# EAGLE design 18V to 26V Boost v3 (National) (EAGLE 6.5.0)
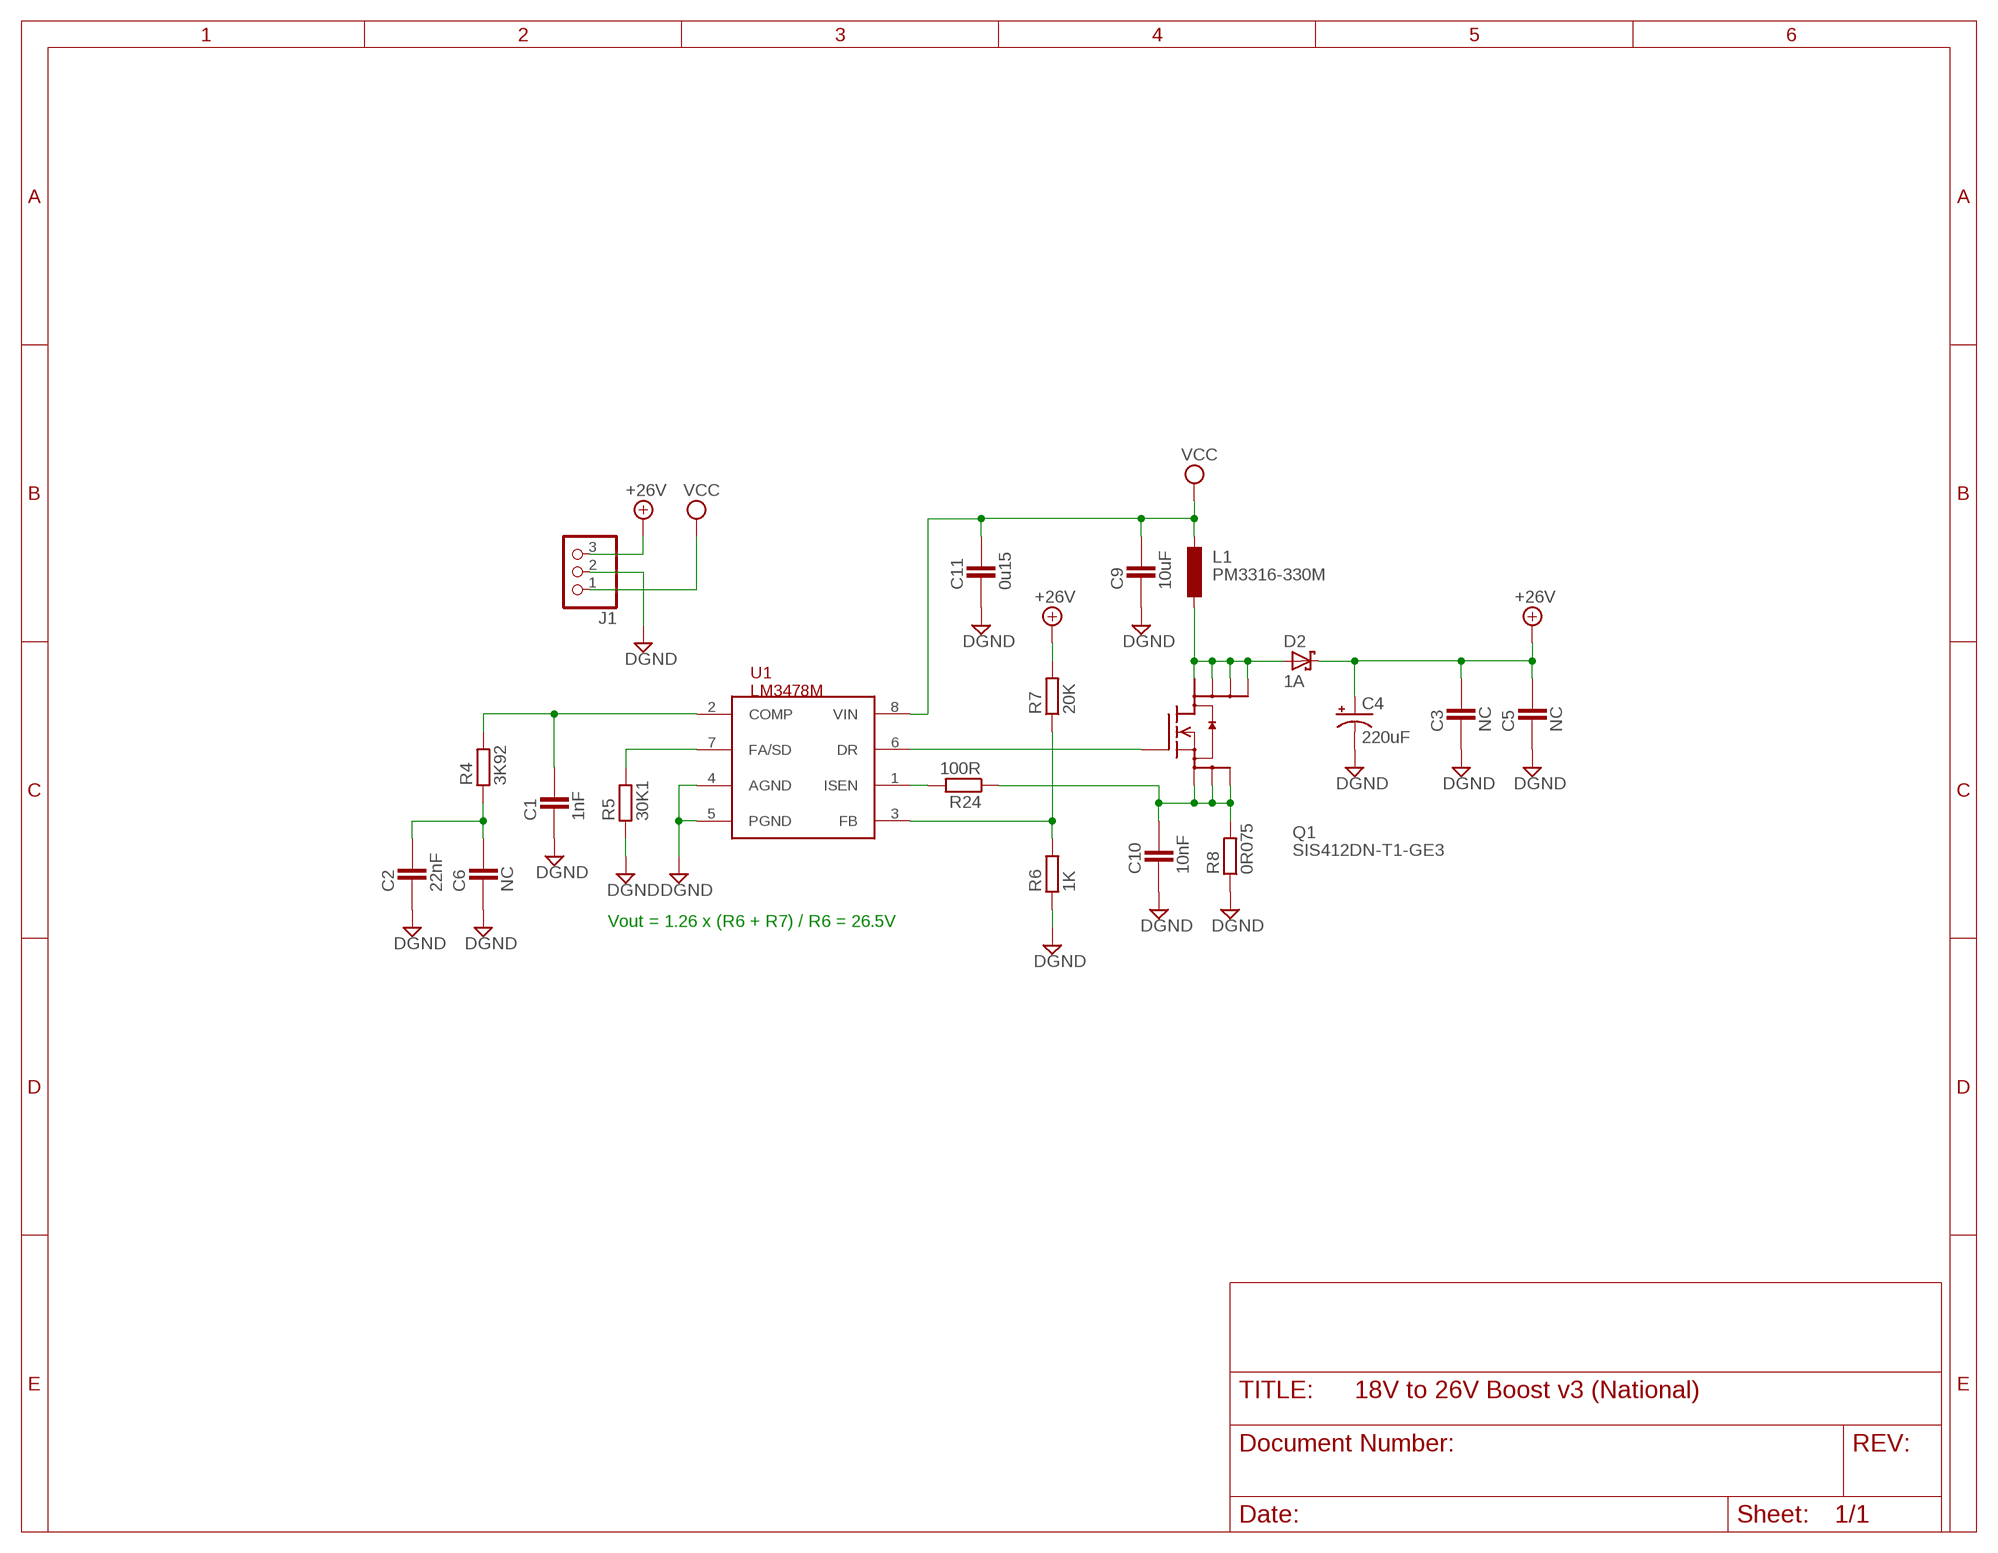
[diagram p0: schematic, sheet 1]

## Parts
C1  1nF  CAPACITOR_0805N  [CAP2012X70N]
C2  22nF  CAPACITOR_0603  [CAPC1608X92N]
C3  NC  CAPACITOR_1210  [CAPC3225X168N]
C4  220uF  CAP_POLG  [PANASONIC_G]
C5  NC  CAPACITOR_1210  [CAPC3225X168N]
C6  NC  CAPACITOR_0603  [CAPC1608X92N]
C9  10uF  CAPACITOR_1210  [CAPC3225X168N]
C10  10nF  CAPACITOR_0603  [CAPC1608X92N]
C11  0u15  CAPACITOR_0805N  [CAP2012X70N]
D2  1A  SCHOTTKY_SMB  [DIOM5436X265N]
J1  PINHD-1X3  [1X03]
L1  PM3316-330M  DO3316P  [DO3316P]
Q1  SIS412DN-T1-GE3  MOSFET-NCH_8_1212  [POWER-PAK1212]
R4  3K92  RESISTOR_0603  [RESC1608X55N]
R5  30K1  RESISTOR_0603  [RESC1608X55N]
R6  1K  RESISTOR_0603  [RESC1608X55N]
R7  20K  RESISTOR_0603  [RESC1608X55N]
R8  0R075  RESISTOR_2512  [RESC6432X70N]
R24  100R  RESISTOR_0603  [RESC1608X55N]
U1  LM3478M  [MSOP08]

## Nets
+26V: C3.2 C4.+ C5.2 D2.K J1.3 R7.2
DGND: C1.1 C2.1 C3.1 C4.- C5.1 C6.1 C9.1 C10.1 C11.1 J1.2 R5.1 R6.1 R8.1 U1.4(AGND) U1.5(PGND)
N$1: C1.2 R4.2 U1.2(COMP)
N$3: C2.2 C6.2 R4.1
N$4: R5.2 U1.7(FA/SD)
N$6: Q1.4(G) U1.6(DR)
N$9: R6.2 R7.1 U1.3(FB)
N$11: C10.2 Q1.1(S1) Q1.2(S2) Q1.3(S3) R8.2 R24.1
N$12: D2.A L1.2 Q1.5(D1) Q1.6(D2) Q1.7(D3) Q1.8(D4)
N$31: R24.2 U1.1(ISEN)
VCC: C9.2 C11.2 J1.1 L1.1 U1.8(VIN)

## Notes on the sheet
- Vout = 1.26 x (R6 + R7) / R6 = 26.5V

## Library data of the parts
C1-C3 C5 C6 C9-C11 = ipc-7351-capacitor:CAPACITOR_
C4 = SparkFun:CAP_POL: Capacitor Polarized These are standard SMD and PTH capacitors. Normally 10uF, 47uF, and 100uF in electrolytic and tantalum varieties. Always verify the external diameter of the through hole cap, it varies with capacity, voltage, and manufacturer. The EIA devices should be standard.
D2 = ipc-7351-diode:SCHOTTKY_
J1 = Misc Conn:PINHD-1X3: PIN HEADER
L1 = inductor-coilcraft:DO3316P: COILCRAFT; OC_FARNELL: unknown; OC_NEWARK: unknown
Q1 = ipc-7351-transistor:MOSFET-NCH_8_
R4-R8 R24 = ipc-7351-resistor:RESISTOR_
U1 = Misc Power:LM3478: Boost Controller Input: 3V-40V

## Board
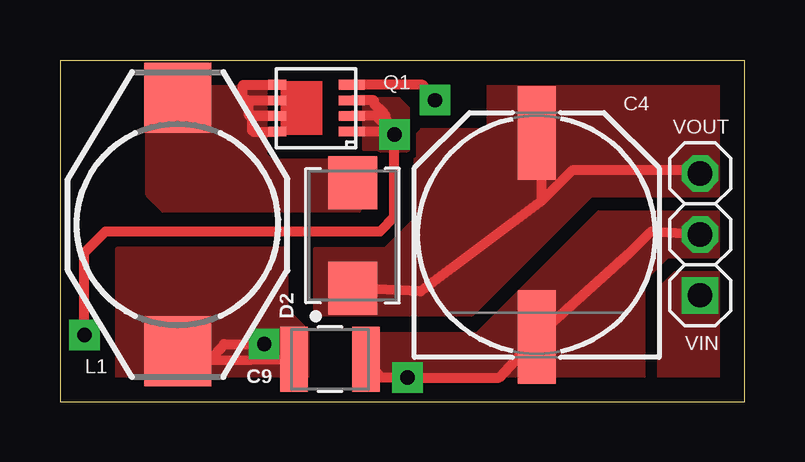
[diagram p1: board, top side]
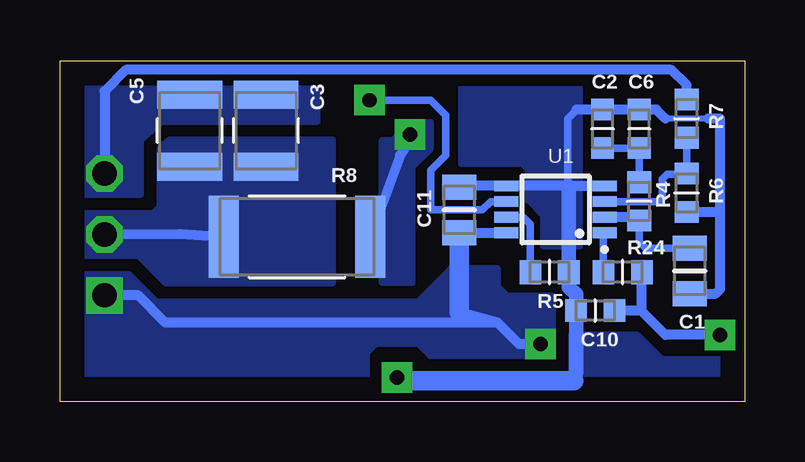
[diagram p2: board, bottom side, seen from below]

Size 28.52 x 14.21 mm. Coordinates in mm from the lower left corner, seen from the top.
Outline: 0,0 28.52,0 28.52,14.21 0,14.21 0,0
Copper layers (1*16): Top 0.035mm / dielectric 1.5mm / Bottom 0.035mm
Design rules "default": minimum track width 10mil, minimum drill 24mil, track to track 8mil, track to pad 8mil, pad to pad 8mil, via to via 8mil, smd to smd 8mil, copper to edge 40mil, drill to drill 8mil, minimum pad ring 10mil, minimum via ring 8mil, stop-mask expansion 4mil, vias tented up to drill 0mil, thermal gap 10mil

### Footprints (pad centres in the part's own frame; a part is rotated, then mirrored left to right if it is on the bottom)
CAP2012X70N = smd 1.05 x 1.4: 1 -0.95,0; 2 0.95,0
CAPC1608X92N = smd 0.9 x 0.95: 1 -0.8,0; 2 0.8,0
CAPC3225X168N = smd 1.15 x 2.7: 1 -1.5,0; 2 1.5,0
PANASONIC_G = smd 3.9 x 1.6: + 4.25,0; - -4.25,0
DIOM5436X265N = smd 2.2 x 2.05: A 2.2,0; K -2.2,0
1X03 = drill 1.016 square: 1 -2.54,0 | drill 1.016 octagon: 2 0,0; 3 2.54,0
DO3316P = smd 2.92 x 2.79: 1 -5.28,0; 2 5.28,0
POWER-PAK1212 = smd 0.4 x 1.1: 1 -0.975,-1.488; 2 -0.325,-1.488; 3 0.325,-1.488; 4 0.975,-1.488 | smd 0.4 x 0.762: 5 0.975,1.615; 6 0.325,1.615; 7 -0.325,1.615; 8 -0.975,1.615
RESC1608X55N = smd 0.9 x 1: 1 -0.8,0; 2 0.8,0
RESC6432X70N = smd 1.25 x 3.4: 1 -3.05,0; 2 3.05,0
MSOP08 = smd 0.45 x 1: 1 -0.975,-2.05; 2 -0.325,-2.05; 3 0.325,-2.05; 4 0.975,-2.05; 5 0.975,2.05; 6 0.325,2.05; 7 -0.325,2.05; 8 -0.975,2.05

### Placement (x,y rotation side)
C1  2.29,5.46 90 bottom
C2  5.92,11.38 270 bottom
C3  19.94,11.3 90 bottom
C4  19.86,6.96 90 top
C5  23.11,11.3 90 bottom
C6  4.39,11.38 270 bottom
C9  11.25,1.78 180 top
C10  6.22,3.81 0 bottom
C11  11.89,8 270 bottom
D2  12.19,6.93 90 top
J1  26.67,6.99 90 top
L1  4.9,7.39 90 top
Q1  10.67,12.24 90 top
R4  4.39,8.36 270 bottom
R5  8.13,5.41 180 bottom
R6  2.41,8.71 90 bottom
R7  2.41,11.81 90 bottom
R8  18.64,6.88 0 bottom
R24  5.08,5.41 180 bottom
U1  7.87,8.03 90 bottom

### Tracks (layer width: path | path; a pad name or v marks a point on that pad's centre or on a via)
+26V
  Top 0.406: 20.07,8.38 20.07,11.29 C4.+ | 20.07,8.38 21.34,9.65 26.54,9.65 J1.3 | 11.46,4.7 D2.K 15.02,4.61 20.07,8.38
  Bottom 0.406: J1.3 26.67,12.95 25.78,13.84 3.05,13.84 2.41,13.21 R7.2
  pour Top (isolate 0.254, rank 2, no thermals): 10.67,3.68 10.67,6.35 13.59,6.35 14.86,7.62 14.86,11.05 15.11,11.3 17.91,11.3 17.91,13.97 28.19,13.97 28.19,9.14 27.69,8.64 22.1,8.64 17.14,3.68
  pour Bottom (no thermals): 25.15,8.64 25.15,10.92 24.26,11.68 17.78,11.68 17.78,13.97 28.19,13.97 28.19,9.14 27.69,8.64
DGND  (via drill 0.6 pad 1.27)
  Top 0.406: J1.2 24.64,7.11 23.67,6.15 C4.- 18.3,1.02 v14.48,1.02 13.39,1.02 C9.1
  Bottom 0.254: 1.52,11.81 3.3,11.81
  Bottom 0.305: 7.33,8.96 7.37,9 7.37,11.81 7,12.18
  Bottom 0.406: R8.1 23.52,7.01 J1.2 | 6.35,9 U1.4 | 6.35,9 7.37,9 U1.5 11.84,9 C11.1 | 6.35,9 6.36,9.01 | 2.22,4.45 C1.1 1.2,4.51 1.02,4.7 1.02,7.87 | 7,12.18 C2.1 C6.1 3.67,12.18 3.3,11.81 | 1.52,11.81 1.02,11.81 1.02,7.87 | R6.1 1.05,7.91 1.02,7.87
  Bottom 0.61: 7.33,8.96 R5.1 7.33,4.79 7.02,4.48 C10.1 7.02,1.23 7.11,0.89
  Bottom 0.813: 7.11,0.89 14.35,0.89 v14.48,1.02
  pour Top (no thermals): 12.32,0.38 12.32,2.79 17.4,2.79 22.48,7.87 27.81,7.87 28.19,7.49 28.19,6.35 27.94,6.1 25.27,6.1 24.26,5.08 24.26,0.38
  pour Bottom (no thermals): 28.19,7.49 28.19,6.35 27.94,6.1 25.27,6.1 24.13,4.95 17.14,4.95 17.14,10.92 24,10.92 24.38,10.54 24.38,8.13 24.64,7.87 27.81,7.87
  pour Bottom (no thermals): 6.86,6.48 8.38,6.48 8.38,7.75 9.02,8.38 9.02,9.65 9.27,9.91 11.81,9.91 11.81,13.08 6.86,13.08
  pour Bottom (no thermals): 0.51,0.64 0.51,1.78 3.43,1.78 4.45,2.79 7.24,2.79 7.24,0.64
N$1
  Bottom 0.305: R4.2 4.39,6.68 4.12,6.41 C1.2
  Bottom 0.406: U1.2 4.54,7.7 R4.2
N$3
  Bottom 0.305: R4.1 C6.2 C2.2
N$4
  Bottom 0.305: R5.2 8.93,7.4 9.22,7.7 U1.7
N$6  (via drill 0.6 pad 1.27)
  Top 0.406: Q1.4 15.12,13.22 v15.62,12.57
  Bottom 0.305: U1.6 10.57,8.35 10.92,8 13.08,8 13.08,9.65 12.45,10.29 12.45,11.94 13.08,12.57 v15.62,12.57
N$9
  Bottom 0.305: U1.3 3.59,8.35 3.43,8.51 3.43,9.27 3.22,9.48 2.44,9.48 R6.2 R7.1
N$11  (via drill 0.6 pad 1.27)
  Top 0.406: Q1.3 13.08,12.57 13.08,12.45 13.46,12.06 13.57,11.92 13.59,11.77 13.97,11.18 v13.94,11.14 | v13.94,11.14 13.46,11.18 13.37,11.27 Q1.1 | Q1.2 13.16,11.92 v13.94,11.14 | v13.94,11.14 13.94,7.71 13.34,7.11 1.91,7.11 1.02,6.22 v1.02,2.79
  Bottom 0.406: R8.2 14.35,10.29 14.22,10.47 v13.94,11.14 | 4.32,5.5 R24.1 4.28,3.77 | 4.28,3.77 4.32,3.81 C10.2 | v1.02,2.79 3.3,2.79 4.28,3.77
  pour Bottom (no thermals): 13.08,11.68 13.08,10.54 13.84,9.78 13.84,4.95 15.11,4.95 15.11,10.92 14.61,10.92 14.1,11.68
  pour Top (no thermals): 12.7,12.57 12.7,10.54 14.48,10.54 14.48,12.19 14.1,12.57
N$12
  Top 0.406: Q1.5 7.63,13.22 7.62,13.21 7.62,12.7 7.75,12.57 7.87,12.57 | Q1.6 7.87,12.57 | 7.87,12.57 7.87,11.94 7.89,11.92 Q1.7 8.02,11.92 8,11.94 8,11.3 8.04,11.27 Q1.8
  pour Top (no thermals): 3.68,13.97 8.26,13.97 8.51,13.72 8.51,10.29 8.76,10.03 12.45,10.03 12.45,8 4.32,8 3.68,8.64
N$31
  Bottom 0.305: R24.2 5.88,7 U1.1
VCC  (via drill 0.6 pad 1.27)
  Top 0.406: 6.24,1.74 5.24,1.78 L1.1 | 6.24,1.74 C9.2 | v8.51,2.41 6.84,2.41 6.24,1.74
  Bottom 0.305: C11.2
  Bottom 0.406: C11.2 U1.8 | 10.29,3.3 24.13,3.3 25.27,4.45 J1.1 | 10.29,3.3 9.4,2.41 v8.51,2.41 | 10.29,3.3 11.89,3.73
  Bottom 0.813: 11.89,3.73 C11.2
  pour Bottom (no thermals): 8,4.45 8,1.91 13.08,1.91 13.59,2.41 15.37,2.41 15.75,2.03 15.75,0.64 16,0.38 28.07,0.38 28.19,5.08 27.94,5.33 25.65,5.33 24.51,4.19 13.59,4.19 12.19,5.59 10.29,5.59 10.29,4.83 9.91,4.45
  pour Top (no thermals): 2.41,6.35 2.41,0.38 10.29,0.38 10.29,2.92 9.4,3.81 9.4,6.35
  pour Top (rank 2, no thermals): 25.65,5.33 27.94,5.33 28.19,5.08 28.19,0.38 25.02,0.38 25.02,4.7

### Text on the board
tPlace: VOUT | VIN